# EAGLE design PSO36 BREKAOUT (EAGLE 8.6.3)
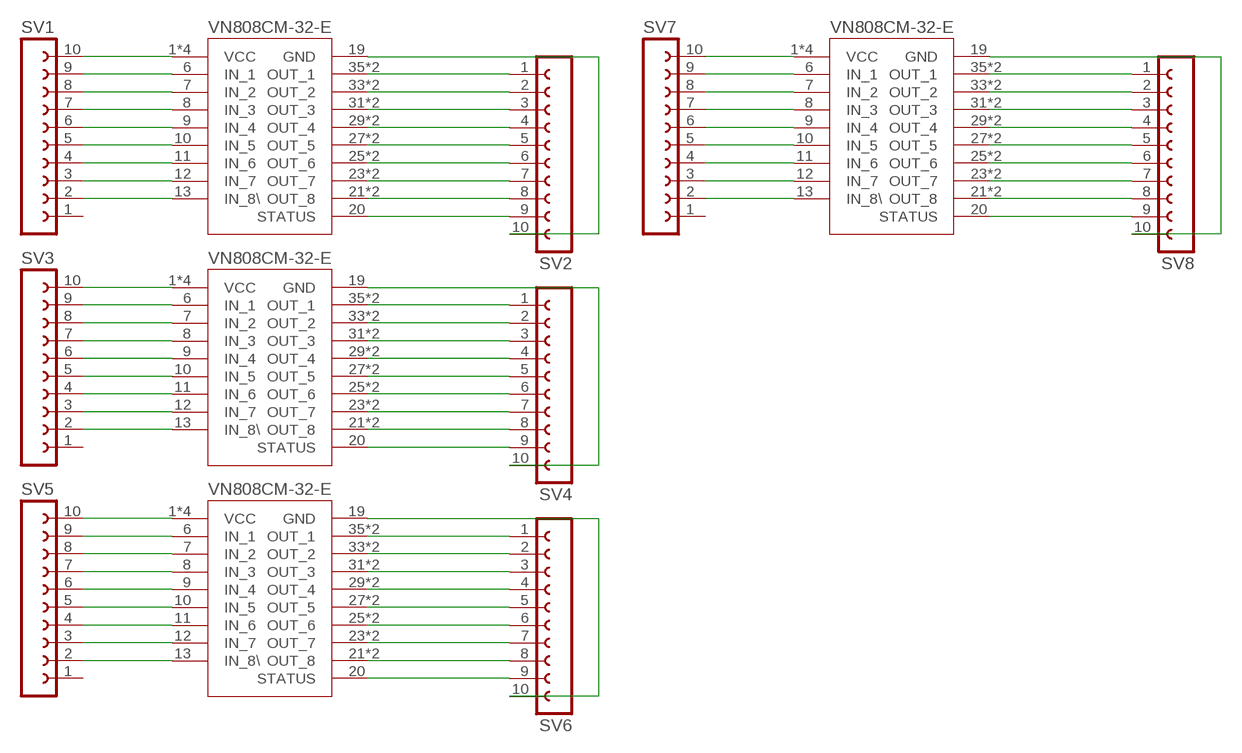
[diagram p0: schematic, sheet 1]

## Parts
SV1  FE10-1  [FE10]
SV2  FE10-1  [FE10]
SV3  FE10-1  [FE10]
SV4  FE10-1  [FE10]
SV5  FE10-1  [FE10]
SV6  FE10-1  [FE10]
SV7  FE10-1  [FE10]
SV8  FE10-1  [FE10]
U$1  VN808CM-32-E  [PSO36]
U$2  VN808CM-32-E  [PSO36]
U$3  VN808CM-32-E  [PSO36]
U$4  VN808CM-32-E  [PSO36]

## Nets
N$1: SV3.2 U$2.13(IN_8\)
N$2: SV2.1 U$1.35(OUT_1) U$1.36(OUT_1)
N$3: SV2.2 U$1.33(OUT_2) U$1.34(OUT_2)
N$4: SV1.2 U$1.13(IN_8\)
N$5: SV1.3 U$1.12(IN_7)
N$6: SV1.4 U$1.11(IN_6)
N$7: SV1.5 U$1.10(IN_5)
N$8: SV1.6 U$1.9(IN_4)
N$9: SV1.7 U$1.8(IN_3)
N$10: SV1.8 U$1.7(IN_2)
N$11: SV1.9 U$1.6(IN_1)
N$12: SV2.3 U$1.31(OUT_3) U$1.32(OUT_3)
N$13: SV2.4 U$1.29(OUT_4) U$1.30(OUT_4)
N$14: SV2.5 U$1.27(OUT_5) U$1.28(OUT_5)
N$15: SV2.6 U$1.25(OUT_6) U$1.26(OUT_6)
N$16: SV2.7 U$1.23(OUT_7) U$1.24(OUT_7)
N$17: SV2.8 U$1.21(OUT_8) U$1.22(OUT_8)
N$18: SV2.9 U$1.20(STATUS)
N$19: SV2.10 U$1.19(GND)
N$20: SV3.3 U$2.12(IN_7)
N$21: SV3.4 U$2.11(IN_6)
N$22: SV3.5 U$2.10(IN_5)
N$23: SV3.6 U$2.9(IN_4)
N$24: SV3.7 U$2.8(IN_3)
N$25: SV3.8 U$2.7(IN_2)
N$26: SV3.9 U$2.6(IN_1)
N$27: SV4.1 U$2.35(OUT_1) U$2.36(OUT_1)
N$28: SV4.2 U$2.33(OUT_2) U$2.34(OUT_2)
N$29: SV4.3 U$2.31(OUT_3) U$2.32(OUT_3)
N$30: SV4.4 U$2.29(OUT_4) U$2.30(OUT_4)
N$31: SV4.5 U$2.27(OUT_5) U$2.28(OUT_5)
N$32: SV4.6 U$2.25(OUT_6) U$2.26(OUT_6)
N$33: SV4.7 U$2.23(OUT_7) U$2.24(OUT_7)
N$34: SV4.8 U$2.21(OUT_8) U$2.22(OUT_8)
N$35: SV4.9 U$2.20(STATUS)
N$36: SV4.10 U$2.19(GND)
N$37: SV5.2 U$3.13(IN_8\)
N$38: SV5.3 U$3.12(IN_7)
N$39: SV5.4 U$3.11(IN_6)
N$40: SV5.5 U$3.10(IN_5)
N$41: SV5.6 U$3.9(IN_4)
N$42: SV5.7 U$3.8(IN_3)
N$43: SV5.8 U$3.7(IN_2)
N$44: SV5.9 U$3.6(IN_1)
N$45: SV6.1 U$3.35(OUT_1) U$3.36(OUT_1)
N$46: SV6.2 U$3.33(OUT_2) U$3.34(OUT_2)
N$47: SV6.3 U$3.31(OUT_3) U$3.32(OUT_3)
N$48: SV6.4 U$3.29(OUT_4) U$3.30(OUT_4)
N$49: SV6.5 U$3.27(OUT_5) U$3.28(OUT_5)
N$50: SV6.6 U$3.25(OUT_6) U$3.26(OUT_6)
N$51: SV6.7 U$3.23(OUT_7) U$3.24(OUT_7)
N$52: SV6.8 U$3.21(OUT_8) U$3.22(OUT_8)
N$53: SV6.9 U$3.20(STATUS)
N$54: SV6.10 U$3.19(GND)
N$55: SV7.2 U$4.13(IN_8\)
N$56: SV7.3 U$4.12(IN_7)
N$57: SV7.4 U$4.11(IN_6)
N$58: SV7.5 U$4.10(IN_5)
N$59: SV7.6 U$4.9(IN_4)
N$60: SV7.7 U$4.8(IN_3)
N$61: SV7.8 U$4.7(IN_2)
N$62: SV7.9 U$4.6(IN_1)
N$63: SV8.1 U$4.35(OUT_1) U$4.36(OUT_1)
N$64: SV8.2 U$4.33(OUT_2) U$4.34(OUT_2)
N$65: SV8.3 U$4.31(OUT_3) U$4.32(OUT_3)
N$66: SV8.4 U$4.29(OUT_4) U$4.30(OUT_4)
N$67: SV8.5 U$4.27(OUT_5) U$4.28(OUT_5)
N$68: SV8.6 U$4.25(OUT_6) U$4.26(OUT_6)
N$69: SV8.7 U$4.23(OUT_7) U$4.24(OUT_7)
N$70: SV8.8 U$4.21(OUT_8) U$4.22(OUT_8)
N$71: SV8.9 U$4.20(STATUS)
N$72: SV8.10 U$4.19(GND)
VCC: SV1.10 U$1.1(VCC) U$1.M@1(VCC) U$1.M@2(VCC) U$1.M@3(VCC)
VCC1: SV3.10 U$2.1(VCC) U$2.M@1(VCC) U$2.M@2(VCC) U$2.M@3(VCC)
VCC2: SV5.10 U$3.1(VCC) U$3.M@1(VCC) U$3.M@2(VCC) U$3.M@3(VCC)
VCC3: SV7.10 U$4.1(VCC) U$4.M@1(VCC) U$4.M@2(VCC) U$4.M@3(VCC)
Unconnected: SV1.1 SV3.1 SV5.1 SV7.1

## Library data of the parts
SV1-SV8 = con-lsta:FE10-1: FEMALE HEADER; OC_FARNELL: unknown; OC_NEWARK: unknown
U$1-U$4 = Lucas Library with vmc:VN808CM-32-E

## Board
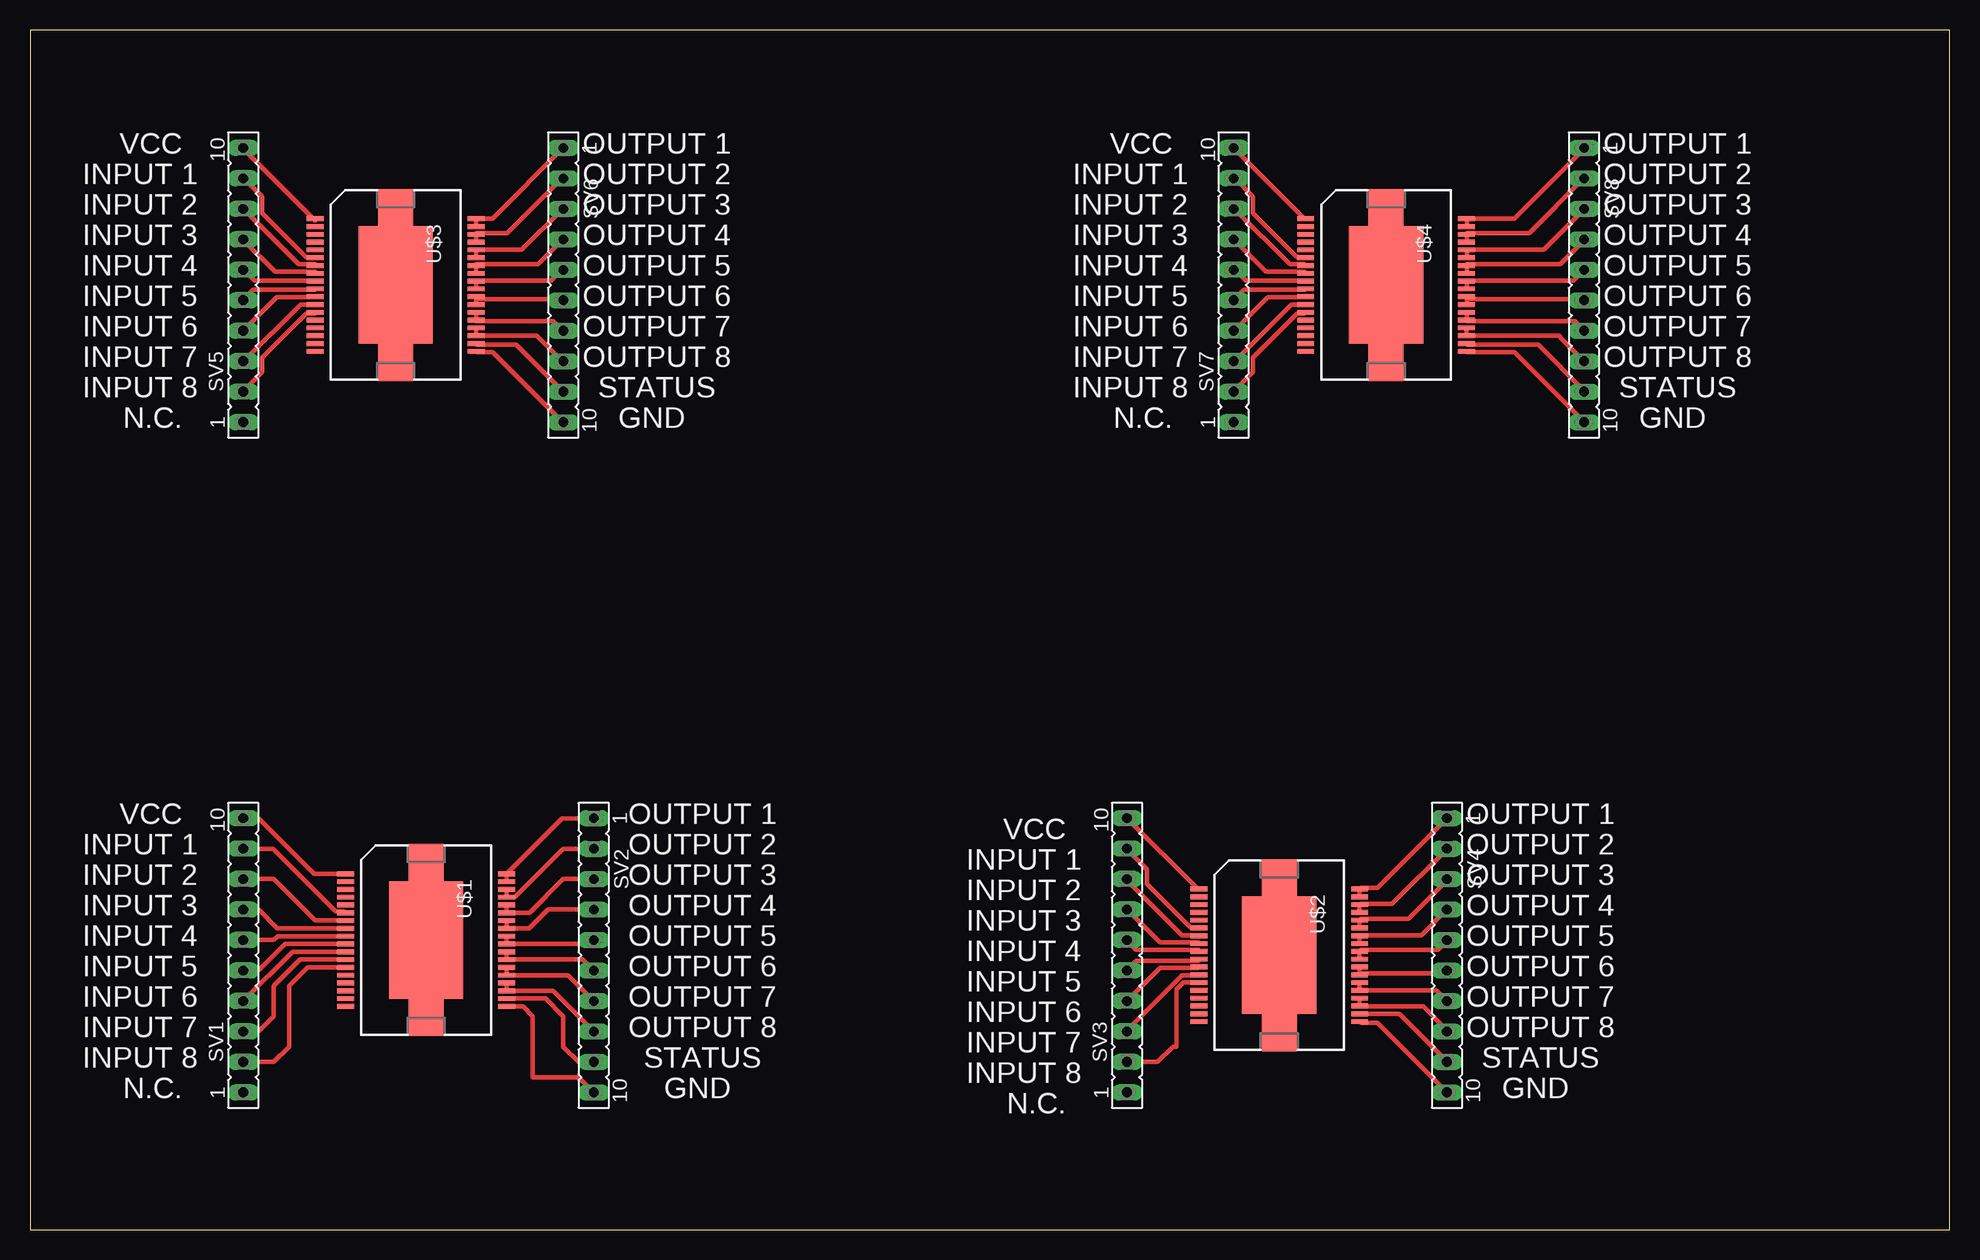
[diagram p1: board, top side]

Size 160 x 100 mm. Coordinates in mm from the lower left corner, seen from the top.
Outline: 0,0 160,0 160,100 0,100 0,0
Copper layers (1*16): Top 0.035mm / dielectric 1.5mm / Bottom 0.035mm
Design rules "default": minimum track width 6mil, minimum drill 0.35mm, track to track 6mil, track to pad 6mil, pad to pad 6mil, via to via 6mil, smd to smd 6mil, copper to edge 40mil, drill to drill 6mil, minimum pad ring 10mil, minimum via ring 8mil, stop-mask expansion 4mil, vias tented up to drill 0mil, thermal gap 10mil

### Footprints (pad centres in the part's own frame; a part is rotated, then mirrored left to right if it is on the bottom)
FE10 = drill 0.813 long: 1 -11.43,0; 2 -8.89,0; 3 -6.35,0; 4 -3.81,0; 5 -1.27,0; 6 1.27,0; 7 3.81,0; 8 6.35,0; 9 8.89,0; 10 11.43,0
PSO36 = smd 0.4 x 1.4: 1 -5.525,-6.7; 2 -4.875,-6.7; 3 -4.225,-6.7; 4 -3.575,-6.7; 5 -2.925,-6.7; 6 -2.275,-6.7; 7 -1.625,-6.7; 8 -0.975,-6.7; 9 -0.325,-6.7; 10 0.325,-6.7; 11 0.975,-6.7; 12 1.625,-6.7; 13 2.275,-6.7; 14 2.925,-6.7; 15 3.575,-6.7; 16 4.225,-6.7; 17 4.875,-6.7; 18 5.525,-6.7; 19 5.525,6.7; 20 4.875,6.7; 21 4.225,6.7; 22 3.575,6.7; 23 2.925,6.7; 24 2.275,6.7; 25 1.625,6.7; 26 0.975,6.7; 27 0.325,6.7; 28 -0.325,6.7; 29 -0.975,6.7; 30 -1.625,6.7; 31 -2.275,6.7; 32 -2.925,6.7; 33 -3.575,6.7; 34 -4.225,6.7; 35 -4.875,6.7; 36 -5.525,6.7 | smd 9.8 x 6.2: M@1 0,0 | smd 3.1 x 2.9: M@2 -6.45,0; M@3 6.45,0

### Placement (x,y rotation side)
SV1  17.78,22.86 90 top
SV2  46.99,22.86 270 top
SV3  91.44,22.86 90 top
SV4  118.11,22.86 270 top
SV5  17.78,78.74 90 top
SV6  44.45,78.74 270 top
SV7  100.33,78.74 90 top
SV8  129.54,78.74 270 top
U$1  33.02,24.13 270 top
U$2  104.14,22.86 270 top
U$3  30.48,78.74 270 top
U$4  113.03,78.74 270 top

### Tracks (layer width: path | path; a pad name or v marks a point on that pad's centre or on a via)
N$1
  Top 0.356: U$2.13 96.13,20.59 95.56,20.01 95.56,15.24 95.25,15.24 93.98,13.97 SV3.2
N$2
  Top 0.356: SV2.1 44.35,34.29 U$1.36 U$1.35
N$3
  Top 0.356: SV2.2 44.45,31.75 40.41,27.7 U$1.33 U$1.34
N$4
  Top 0.356: U$1.13 23.12,21.86 21.59,20.32 21.59,15.24 20.32,13.97 SV1.2
N$5
  Top 0.356: U$1.12 22.5,22.5 20.32,20.32 20.32,17.78 19.05,16.51 SV1.3
N$6
  Top 0.356: U$1.11 21.89,23.16 SV1.4
N$7
  Top 0.356: U$1.10 21.27,23.8 19.05,21.59 SV1.5
N$8
  Top 0.356: U$1.9 20.64,24.45 20.32,24.13 SV1.6
N$9
  Top 0.356: U$1.8 20.61,25.11 19.05,26.67 SV1.7
N$10
  Top 0.356: U$1.7 23.77,25.75 20.32,29.21 SV1.8
N$11
  Top 0.356: U$1.6 26.2,26.52 25.48,26.52 20.26,31.75 SV1.9
N$12
  Top 0.356: U$1.32 U$1.31 41.65,26.41 44.45,29.21 SV2.3
N$13
  Top 0.356: SV2.4 43.18,26.67 41.62,25.11 U$1.29 U$1.30
N$14
  Top 0.356: U$1.28 U$1.27 46.66,23.8 SV2.5
N$15
  Top 0.356: U$1.26 U$1.25 46.08,22.5 SV2.6
N$16
  Top 0.356: U$1.24 U$1.23 44.84,21.2 SV2.7
N$17
  Top 0.356: U$1.22 U$1.21 43.59,19.91 SV2.8
N$18
  Top 0.356: U$1.20 42.98,19.25 44.45,17.78 44.45,15.24 45.72,13.97 SV2.9
N$19
  Top 0.356: U$1.19 41.09,18.61 41.91,17.78 41.91,12.7 45.72,12.7 SV2.10
N$20
  Top 0.356: U$2.12 97.38,21.18 96.01,21.18 91.44,16.61 SV3.3
N$21
  Top 0.356: SV3.4 94.18,21.79 97.38,21.79 U$2.11
N$22
  Top 0.356: U$2.10 97.38,22.4 92.2,22.4 91.44,21.64 SV3.5
N$23
  Top 0.356: U$2.9 97.38,23.32 92.2,23.32 91.44,24.08 SV3.6
N$24
  Top 0.356: SV3.7 94.18,23.93 97.38,23.93 U$2.8
N$25
  Top 0.356: U$2.7 97.38,24.54 96.01,24.54 91.44,29.11 SV3.8
N$26
  Top 0.356: U$2.6 97.38,25.15 96.77,25.15 93.12,28.8 93.12,30.02 91.44,31.7 SV3.9
N$27
  Top 0.356: U$2.35 110.8,27.74 110.8,28.35 U$2.36 110.95,28.5 112.32,28.5 SV4.1
N$28
  Top 0.356: U$2.33 110.8,26.52 110.8,26.98 U$2.34 110.95,27.13 113.54,27.13 118.11,31.7 SV4.2
N$29
  Top 0.356: U$2.31 110.8,25.15 110.8,25.76 U$2.32 110.95,25.91 114.91,25.91 118.11,29.11 SV4.3
N$30
  Top 0.356: U$2.29 110.8,23.93 110.8,24.38 U$2.30 110.95,24.54 115.98,24.54 SV4.4
N$31
  Top 0.356: U$2.27 110.8,22.55 110.8,23.16 U$2.28 110.95,23.32 117.35,23.32 118.11,24.08 SV4.5
N$32
  Top 0.356: U$2.26 110.8,21.79 110.8,21.34 U$2.25 110.95,21.34 117.96,21.34 118.11,21.49 SV4.6
N$33
  Top 0.356: 110.8,20.57 U$2.24 110.8,20.54 110.8,19.96 U$2.23 117.22,19.93 SV4.7
N$34
  Top 0.356: U$2.22 110.8,19.2 110.8,18.75 U$2.21 110.95,18.59 116.13,18.59 118.11,16.61 SV4.8
N$35
  Top 0.356: U$2.20 110.95,17.98 114.15,17.98 118.11,14.02 SV4.9
N$36
  Top 0.356: SV4.10 112.32,17.22 110.95,17.22 U$2.19
N$37
  Top 0.356: U$3.13 23.77,76.35 23.01,76.35 19.36,72.69 19.36,71.48 17.83,69.95 SV5.2
N$38
  Top 0.356: U$3.12 22.55,77.11 17.83,72.39 SV5.3
N$39
  Top 0.356: SV5.4 20.57,77.72 23.77,77.72 U$3.11
N$40
  Top 0.356: U$3.10 23.77,78.33 18.59,78.33 17.83,77.57 SV5.5
N$41
  Top 0.356: U$3.9 23.77,79.1 18.75,79.1 17.83,80.01 SV5.6
N$42
  Top 0.356: U$3.8 23.77,79.86 20.42,79.86 17.83,82.45 SV5.7
N$43
  Top 0.356: SV5.8 22.4,80.47 23.77,80.47 U$3.7
N$44
  Top 0.356: U$3.6 23.77,81.08 23.01,81.08 19.36,84.73 19.36,86.11 17.83,87.63 SV5.9
N$45
  Top 0.356: U$3.35 37.19,83.67 37.19,84.12 U$3.36 38.56,84.28 SV6.1
N$46
  Top 0.356: U$3.33 37.19,82.45 37.19,82.91 U$3.34 37.19,83.06 39.78,83.06 44.35,87.63 SV6.2
N$47
  Top 0.356: U$3.31 37.19,81.08 37.19,81.53 U$3.32 37.19,81.69 41,81.69 44.35,85.04 SV6.3
N$48
  Top 0.356: U$3.29 37.19,79.86 37.19,80.31 U$3.30 37.19,80.47 42.37,80.47 SV6.4
N$49
  Top 0.356: U$3.27 37.19,78.49 37.19,78.94 U$3.28 37.19,79.1 43.43,79.1 44.35,80.01 SV6.5
N$50
  Top 0.356: 37.19,77.57 37.19,77.72 U$3.26 37.19,77.57 | 37.19,77.57 37.19,77.27 U$3.25 | 37.19,77.57 44.35,77.57 SV6.6
N$51
  Top 0.356: U$3.24 37.19,76.35 37.19,75.89 U$3.23 37.19,75.74 43.59,75.74 44.35,74.98 SV6.7
N$52
  Top 0.356: 37.19,75.13 U$3.22 U$3.21 arc90 U$3.21 42.22,74.52 44.35,72.39 SV6.8
N$53
  Top 0.356: SV6.9 40.54,73.76 37.19,73.76 U$3.20
N$54
  Top 0.356: U$3.19 37.19,73.15 38.56,73.15 44.35,67.36 SV6.10
N$55
  Top 0.356: SV7.2 101.96,71.48 101.96,72.69 105.61,76.35 106.22,76.35 U$4.13
N$56
  Top 0.356: U$4.12 106.22,77.11 105.16,77.11 100.43,72.39 SV7.3
N$57
  Top 0.356: U$4.11 106.22,77.72 103.17,77.72 100.43,74.98 SV7.4
N$58
  Top 0.356: SV7.5 101.19,78.33 106.22,78.33 U$4.10
N$59
  Top 0.356: U$4.9 106.22,79.1 101.35,79.1 100.43,80.01 SV7.6
N$60
  Top 0.356: SV7.7 103.02,79.86 106.22,79.86 U$4.8
N$61
  Top 0.356: U$4.7 106.22,80.47 105,80.47 100.43,85.04 SV7.8
N$62
  Top 0.356: U$4.6 106.22,81.08 105.61,81.08 101.96,84.73 101.96,86.11 100.43,87.63 SV7.9
N$63
  Top 0.356: U$4.35 119.79,83.67 119.79,84.12 U$4.36 119.79,84.28 123.75,84.28 129.54,90.07 SV8.1
N$64
  Top 0.356: U$4.33 119.79,82.45 119.79,82.91 U$4.34 119.79,83.06 124.97,83.06 SV8.2
N$65
  Top 0.356: U$4.31 119.79,81.08 119.79,81.53 U$4.32 119.79,81.69 126.19,81.69 129.54,85.04 SV8.3
N$66
  Top 0.356: U$4.29 119.79,79.86 119.79,80.31 U$4.30 119.79,80.47 127.56,80.47 129.54,82.45 SV8.4
N$67
  Top 0.356: U$4.27 119.79,78.49 119.79,78.94 U$4.28 119.79,79.1 128.63,79.1 SV8.5
N$68
  Top 0.356: 119.79,77.57 119.79,77.72 U$4.26 119.79,77.57 | 119.79,77.57 119.79,77.27 U$4.25 | 119.79,77.57 129.54,77.57 SV8.6
N$69
  Top 0.356: U$4.24 119.79,76.35 119.79,75.89 U$4.23 119.79,75.74 128.78,75.74 129.54,74.98 SV8.7
N$70
  Top 0.356: 119.79,75.13 U$4.22 119.73,74.58 arc90 119.79,74.52 U$4.21 127.42,74.52 arc-90 127.56,74.37 SV8.8
N$71
  Top 0.356: U$4.20 119.79,73.76 125.73,73.76 129.54,69.95 SV8.9
N$72
  Top 0.356: U$4.19 119.79,73.15 123.75,73.15 129.54,67.36 SV8.10
VCC
  Top 0.356: U$1.1 23.68,29.66 19.05,34.29 SV1.10
VCC1
  Top 0.356: SV3.10 97.38,28.35 U$2.1
VCC2
  Top 0.356: SV5.10 17.83,90.07 23.77,84.12 U$3.1
VCC3
  Top 0.356: SV7.10 106.22,84.28 U$4.1

### Text on the board
tNames: VCC | OUTPUT 1 | VCC | OUTPUT 1 | INPUT 1 | OUTPUT 2 | INPUT 1 | OUTPUT 2 | INPUT 2 | OUTPUT 3 | INPUT 2 | OUTPUT 3 | INPUT 3 | OUTPUT 4 | INPUT 3 | OUTPUT 4 | INPUT 4 | OUTPUT 5 | INPUT 4 | OUTPUT 5 | INPUT 5 | OUTPUT 6 | INPUT 5 | OUTPUT 6 | INPUT 6 | OUTPUT 7 | INPUT 6 | OUTPUT 7 | INPUT 7 | OUTPUT 8 | INPUT 7 | OUTPUT 8 | INPUT 8 | STATUS | INPUT 8 | STATUS | N.C. | GND | N.C. | GND | VCC | OUTPUT 1 | OUTPUT 1 | VCC | INPUT 1 | OUTPUT 2 | OUTPUT 2 | INPUT 1 | INPUT 2 | OUTPUT 3 | OUTPUT 3 | INPUT 2 | INPUT 3 | OUTPUT 4 | OUTPUT 4 | INPUT 3 | INPUT 4 | OUTPUT 5 | OUTPUT 5 | INPUT 4 | INPUT 5 | OUTPUT 6 | OUTPUT 6 | INPUT 5 | INPUT 6 | OUTPUT 7 | OUTPUT 7 | INPUT 6 | INPUT 7 | OUTPUT 8 | OUTPUT 8 | INPUT 7 | INPUT 8 | STATUS | STATUS | INPUT 8 | N.C. | GND | GND | N.C.